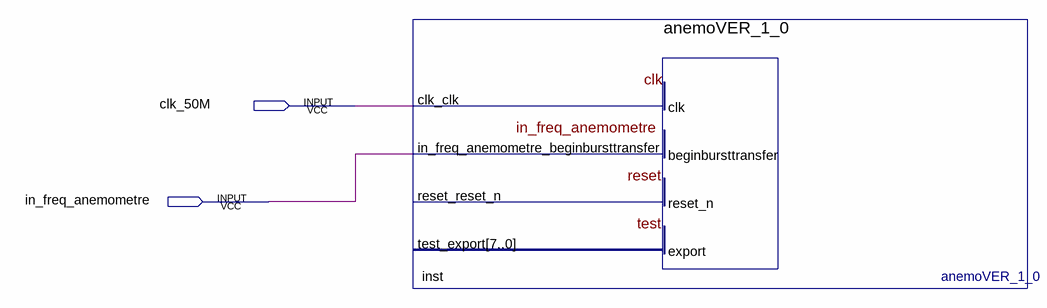
[diagram p0: schematic sheet]
// Quartus schematic test_anemometre_prav.bdf as structural Verilog: 1 symbols, 2 pins
module test_anemometre_prav (
  input  clk_50M,
  input  in_freq_anemometre
);

  anemoVER_1_0 inst (
    .clk_clk(clk_50M), .in_freq_anemometre_beginbursttransfer(in_freq_anemometre));  // open: reset_reset_n, test_export
endmodule
